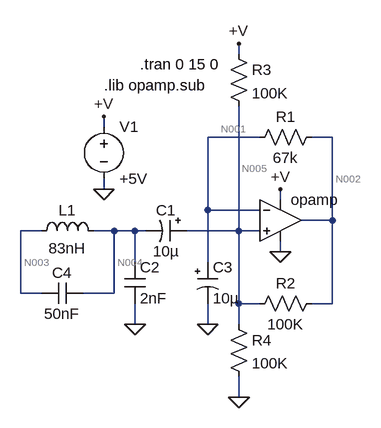
[diagram p0: schematic capacentimetro.asc]
capacentimetro.asc, the LTspice schematic file:
Version 4
SHEET 1 880 680
WIRE 144 -80 144 -96
WIRE -64 32 -64 16
WIRE 176 48 96 48
WIRE 288 48 256 48
WIRE -64 128 -64 112
WIRE 208 144 208 128
WIRE 96 160 96 48
WIRE 176 160 96 160
WIRE 288 176 288 48
WIRE 288 176 240 176
WIRE -160 192 -192 192
WIRE -48 192 -80 192
WIRE -16 192 -48 192
WIRE 0 192 -16 192
WIRE 144 192 144 0
WIRE 144 192 64 192
WIRE 176 192 144 192
WIRE 208 224 208 208
WIRE -16 240 -16 192
WIRE 96 240 96 160
WIRE -192 288 -192 192
WIRE -160 288 -192 288
WIRE -48 288 -48 192
WIRE -48 288 -96 288
WIRE 144 304 144 192
WIRE 176 304 144 304
WIRE 288 304 288 176
WIRE 288 304 256 304
WIRE -16 336 -16 304
WIRE 96 336 96 304
WIRE 144 336 144 304
WIRE 144 448 144 416
FLAG -64 128 0
FLAG -64 16 +V
FLAG 208 128 +V
FLAG 208 224 0
FLAG -16 336 0
FLAG 96 336 0
FLAG 144 -96 +V
FLAG 144 448 0
SYMBOL Opamps\\UniversalOpamp2 208 176 R0
SYMATTR InstName opamp
SYMBOL voltage -64 16 R0
SYMATTR InstName V1
SYMATTR Value +5V
SYMBOL polcap 64 176 R90
WINDOW 0 0 32 VBottom 2
WINDOW 3 32 32 VTop 2
SYMATTR InstName C1
SYMATTR Value 10µ
SYMATTR Description Capacitor
SYMATTR Type cap
SYMATTR SpiceLine V=16 Irms=35m Rser=2.8 Lser=0 mfg="Nichicon" pn="UPR1C100MAH" type="Al electrolytic"
SYMBOL cap -32 240 R0
SYMATTR InstName C2
SYMATTR Value 2nF
SYMBOL polcap 80 240 R0
SYMATTR InstName C3
SYMATTR Value 10µ
SYMATTR Description Capacitor
SYMATTR Type cap
SYMATTR SpiceLine V=16 Irms=35m Rser=2.8 Lser=0 mfg="Nichicon" pn="UPR1C100MAH" type="Al electrolytic"
SYMBOL res 160 64 R270
WINDOW 0 32 56 VTop 2
WINDOW 3 0 56 VBottom 2
SYMATTR InstName R1
SYMATTR Value 67k
SYMBOL res 160 320 R270
WINDOW 0 32 56 VTop 2
WINDOW 3 0 56 VBottom 2
SYMATTR InstName R2
SYMATTR Value 100K
SYMBOL res 128 -96 R0
SYMATTR InstName R3
SYMATTR Value 100K
SYMBOL res 128 320 R0
SYMATTR InstName R4
SYMATTR Value 100K
SYMBOL ind -176 208 R270
WINDOW 0 32 56 VTop 2
WINDOW 3 5 56 VBottom 2
SYMATTR InstName L1
SYMATTR Value 83nH
SYMBOL cap -96 272 R90
WINDOW 0 0 32 VBottom 2
WINDOW 3 32 32 VTop 2
SYMATTR InstName C4
SYMATTR Value 50nF
TEXT -8 -64 Left 2 !.tran 0 15 0
TEXT -64 -32 Left 2 !.lib opamp.sub

The netlist it stands for:
* capacentimetro.asc
Xopamp N005 N001 +V 0 N002 level.2 Avol=1Meg GBW=10Meg Slew=10Meg ilimit=25m rail=0 Vos=0 phimargin=45 en=0 enk=0 in=0 ink=0 Rin=500Meg  ; pins IN+ IN- V+ V- OUT
V1 +V 0 +5V
C1 N005 N004 10µ V=16 Irms=35m Rser=2.8 Lser=0 mfg="Nichicon" pn="UPR1C100MAH" type="Al electrolytic"
C2 N004 0 2nF
C3 N001 0 10µ V=16 Irms=35m Rser=2.8 Lser=0 mfg="Nichicon" pn="UPR1C100MAH" type="Al electrolytic"
R1 N001 N002 67k
R2 N005 N002 100K
R3 +V N005 100K
R4 N005 0 100K
L1 N003 N004 83nH
C4 N004 N003 50nF
.tran 0 15 0
.lib opamp.sub
.lib UniversalOpamps2.sub
.backanno
.end

* Results of the author's LTspice run, read from the files saved beside the schematic
* Operating Point, zero values left out:
*   V(n002) = 2.5 V
*   V(+v) = 5 V
*   V(n001) = 2.5 V
*   V(n005) = 2.5 V
*   V(n004) = 24.43 µV
*   V(n003) = 24.43 µV
*   I(R4) = 25 µA
*   I(R3) = 25 µA
*   I(V1) = -275 µA
*   Ix(opamp:3) = 250 µA
*   Ix(opamp:4) = -250 µA
*   Ix(opamp:5) = 196.1 pA
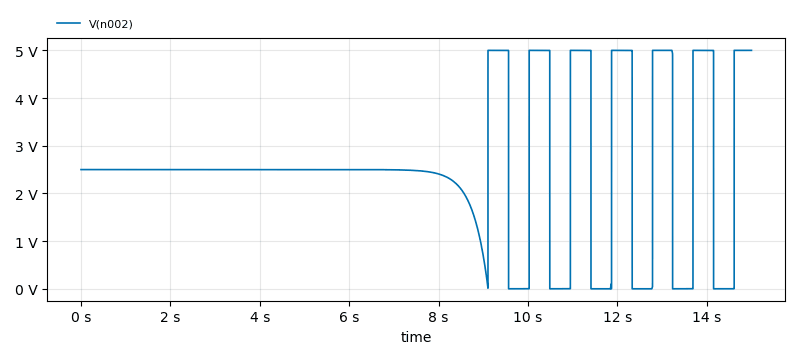
[diagram p1: Transient Analysis of capacentimetro.asc, plotted from the saved traces]
* Transient Analysis, 1 run:
*   V(n002): min 500 µV, max 5 V, average 2.509 V, rms 2.969 V, last 5 V